# EAGLE design LBS-Simpleceiver Audio Pre-Amp and Amp Stage (EAGLE 9.2.2)
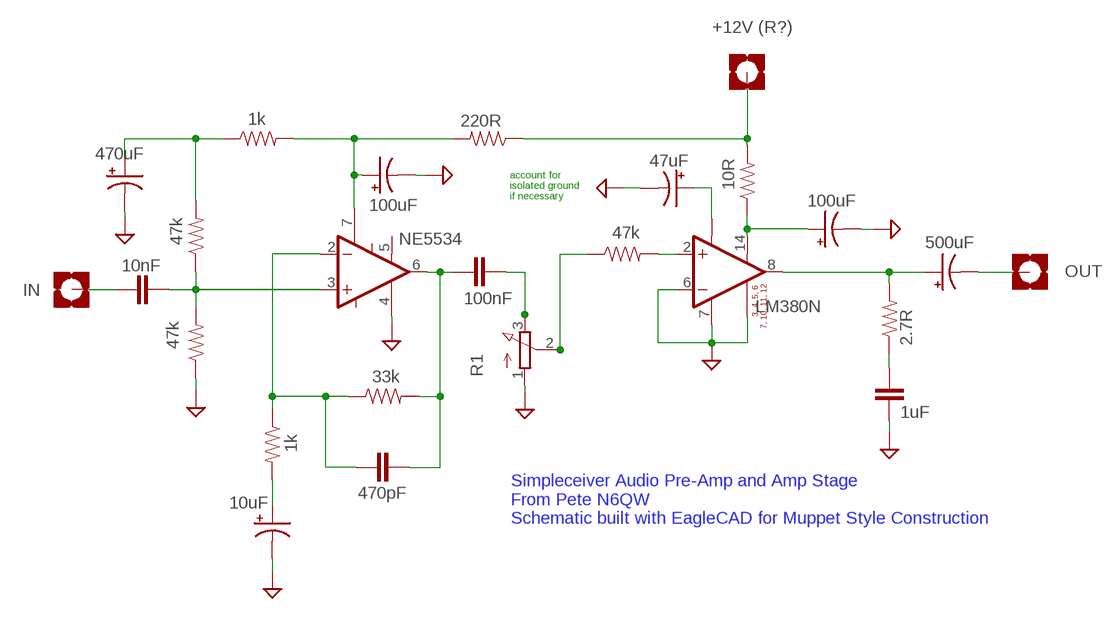
[diagram p0: schematic, sheet 1]

## Parts
C1  470uF  CAP-POLARIZED-RADIAL-2.5MM-25V-20%  [CAP-POLARIZED]
C2  100uF  CAP-POLARIZED-RADIAL-2.5MM-25V-20%  [CAP-POLARIZED]
C3  500uF  CAP-POLARIZED-RADIAL-2.5MM-25V-20%  [CAP-POLARIZED]
C4  47uF  CAP-POLARIZED-RADIAL-2.5MM-25V-20%  [CAP-POLARIZED]
C5  10uF  CAP-POLARIZED-RADIAL-2.5MM-25V-20%  [CAP-POLARIZED]
C6  100uF  CAP-POLARIZED-RADIAL-2.5MM-25V-20%  [CAP-POLARIZED]
C7  10nF  CAP-MEDIUM-MUPPET  [CAP-MEDIUM-MUPPET]
C8  100nF  CAP-MEDIUM-MUPPET  [CAP-MEDIUM-MUPPET]
C9  1uF  CAP-MEDIUM-MUPPET  [CAP-MEDIUM-MUPPET]
C10  470pF  CAP-MEDIUM-MUPPET  [CAP-MEDIUM-MUPPET]
H1  IN  MOUNT-PAD-SQUARE4.5  [PAD-SQUARE]
H2  OUT  MOUNT-PAD-SQUARE4.5  [PAD-SQUARE]
H3  +12V (R?)  MOUNT-PAD-SQUARE4.5  [PAD-SQUARE]
IC1  NE5534  NE5534-OP-AMPDIL8  [DIL08]
R1  POTENTIOMETER  [POTENTIOMETER]
R2  47k  RESISTOR-MUPPETMEDIUM-RESISTOR-PADS  [RESITOR-MUPPET]
R3  47k  RESISTOR-MUPPETMEDIUM-RESISTOR-PADS  [RESITOR-MUPPET]
R4  1k  RESISTOR-MUPPETMEDIUM-RESISTOR-PADS  [RESITOR-MUPPET]
R5  33k  RESISTOR-MUPPETMEDIUM-RESISTOR-PADS  [RESITOR-MUPPET]
R8  220R  RESISTOR-MUPPETMEDIUM-RESISTOR-PADS  [RESITOR-MUPPET]
R9  2.7R  RESISTOR-MUPPETMEDIUM-RESISTOR-PADS  [RESITOR-MUPPET]
U1  LM380N  LM380N-AUDIO-PWR-AMPDIL14  [DIL14]
U$4  1k  RESISTOR-MUPPETMEDIUM-RESISTOR-PADS  [RESITOR-MUPPET]
U$6  47k  RESISTOR-MUPPETMEDIUM-RESISTOR-PADS  [RESITOR-MUPPET]
U$7  10R  RESISTOR-MUPPETMEDIUM-RESISTOR-PADS  [RESITOR-MUPPET]

## Nets
GND: C1.2(-) C2.2(-) C4.2(-) C5.2(-) C6.2(-) C9.2 IC1.4(VCC-GND) R1.1(A) R3.P$1 U1.3(GND) U1.4(GND) U1.5(GND) U1.6(-IN) U1.7(GND1) U1.10(GND) U1.11(GND) U1.12(GND)
N$1: C7.1 H1.PAD(MOUNT)
N$2: C7.2 IC1.3(+IN) R2.P$1 R3.P$2
N$3: C1.1(+) R2.P$2 R4.P$1
N$4: C6.1(+) IC1.7(VCC+) R4.P$2 R8.P$2
N$5: C8.2 C10.1 IC1.6(OUT) R5.P$2
N$6: C10.2 IC1.2(-IN) R5.P$1 U$4.P$1
N$7: C5.1(+) U$4.P$2
N$8: C8.1 R1.3(E)
N$9: R1.2(S) U$6.P$1
N$10: U1.2(+IN) U$6.P$2
N$11: C2.1(+) U1.14(V-SIG) U$7.P$1
N$12: H3.PAD(MOUNT) R8.P$1 U$7.P$2
N$13: C3.1(+) R9.P$2 U1.8(GAIN)
N$14: C9.1 R9.P$1
N$15: C4.1(+) U1.1(BYPASS)
N$16: C3.2(-) H2.PAD(MOUNT)
Unconnected: IC1.1(BALANCE) IC1.5(COMP) IC1.8(COMP/BAL)

## Notes on the sheet
- account for 
  isolated ground
  if necessary
- Simpleceiver Audio Pre-Amp and Amp Stage
  From Pete N6QW 
  Schematic built with EagleCAD for Muppet Style Construction

## Library data of the parts
C1 C3-C5 = jim_muppet_parts:CAP-POLARIZED: 100µF polarized capacitors A capacitor is a passive two-terminal electrical component used to store electrical energy temporarily in an electric field.; PROD_ID: CAP-08439; VALUE: 100uF
C2 C6 = jim_muppet_parts:CAP-POLARIZED: 100µF polarized capacitors A capacitor is a passive two-terminal electrical component used to store electrical energy temporarily in an electric field.; PROD_ID: CAP-08439
C7-C10 = jim_muppet_parts:CAP-MEDIUM-MUPPET: Capacitor - Muppet style - Medium size SMT Pads 120 square SMT pads; PROD_ID: JIM-CAP Large SMT; VALUE: Set 0.0uF
H1-H3 = jim_muppet_parts:MOUNT-PAD-SQUARE: MOUNTING PAD, square
IC1 = jim_muppet_parts:NE5534-OP-AMP: NE5534x, SA5534x Low-Noise Operational Amplifiers
R1 = jim_muppet_parts:POTENTIOMETER: 16mm Potentiometer one level Source: http://www.alphapotentiometers.net/html/16mm_pot_2.html
R2-R5 R8 R9 U$4 U$6 U$7 = jim_muppet_parts:RESISTOR-MUPPET: Muppet stype resitor 120 square pad; PROD_ID: MUP-RES; VALUE: ohm
U1 = jim_muppet_parts:LM380N-AUDIO-PWR-AMP: 2.5W Audio Power Amplifier

## Net classes
0 default: width 0.813 mm, clearance 1.016 mm

## Board
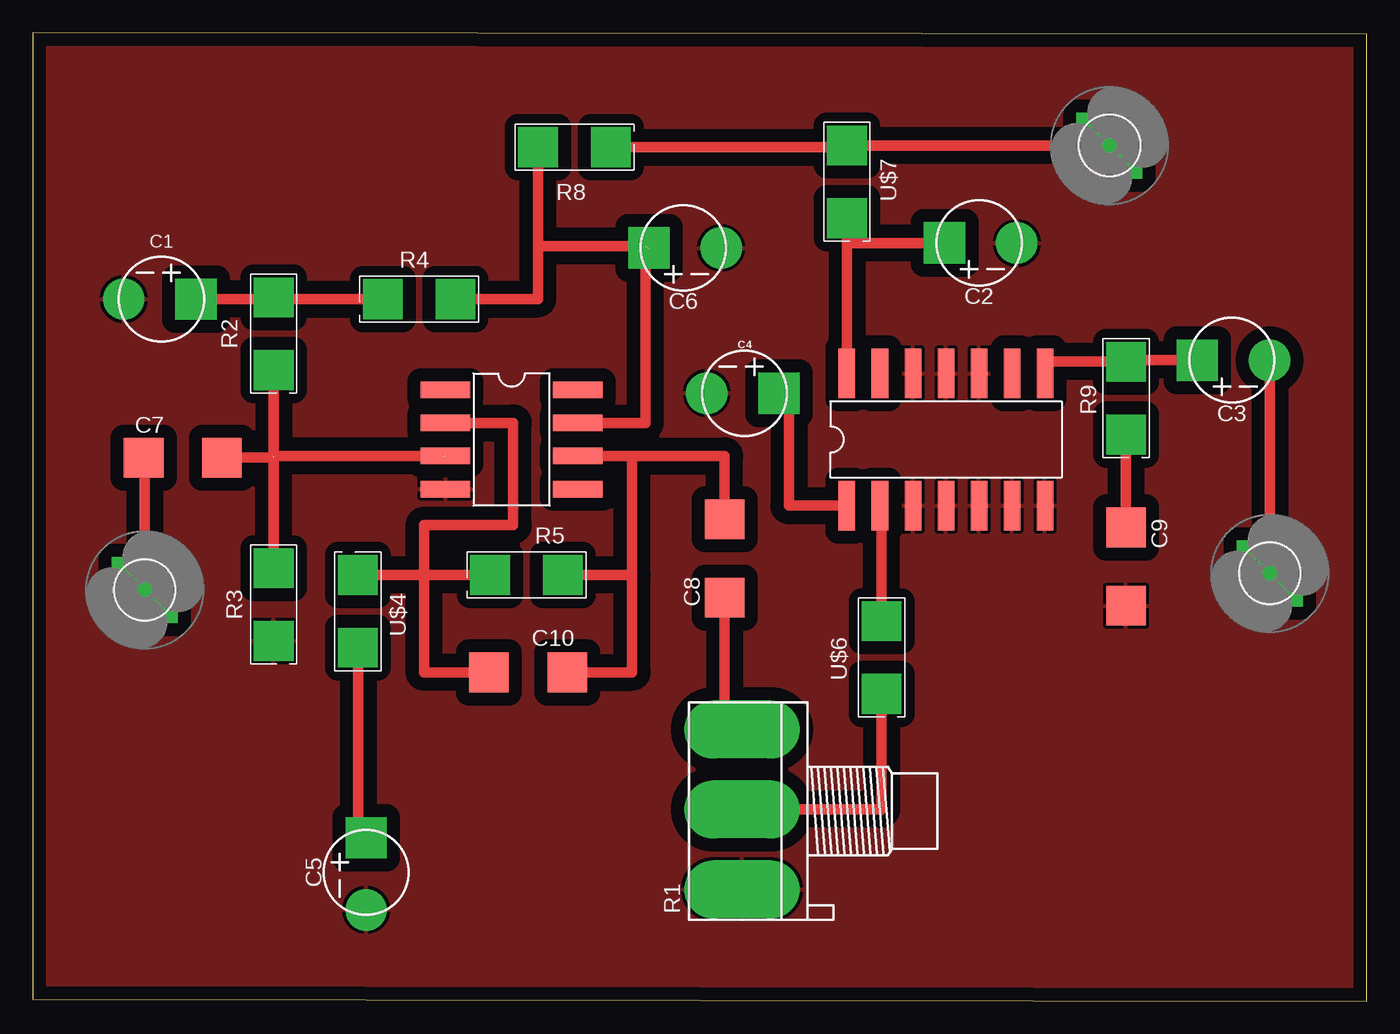
[diagram p1: board, top side]

Size 102.6 x 74.47 mm. Coordinates in mm from the lower left corner, seen from the top.
Outline: 0,0.13 102.6,0 102.6,74.35 0,74.47 0,0.13
Copper layers (1*16): Top 0.035mm / dielectric 1.5mm / Bottom 0.035mm
Design rules "default": minimum track width 6mil, minimum drill 0.35mm, track to track 6mil, track to pad 6mil, pad to pad 6mil, via to via 6mil, smd to smd 6mil, copper to edge 40mil, drill to drill 6mil, minimum pad ring 10mil, minimum via ring 8mil, stop-mask expansion 4mil, vias tented up to drill 0mil, thermal gap 10mil

### Footprints (pad centres in the part's own frame; a part is rotated, then mirrored left to right if it is on the bottom)
CAP-POLARIZED = drill 0 pad 3.175 square: 1 2.647,0 | drill 0 pad 3.175: 2 -2.901,0
CAP-MEDIUM-MUPPET = smd 3.048 x 3.048: 1 -3.009,0; 2 3.009,0
PAD-SQUARE = drill 0 pad 5.08 square: PAD 0,0
DIL08 = smd 1.27 x 3.81: 1 -3.81,-5.08; 2 -1.27,-5.08; 3 1.27,-5.08; 4 3.81,-5.08; 5 3.81,5.08; 6 1.27,5.08; 7 -1.27,5.08; 8 -3.81,5.08
POTENTIOMETER = drill 0 pad 4.445 offset: 1 -6.016,-0.889; 2 0.127,-0.889; 3 6.27,-0.889
RESITOR-MUPPET = drill 0 pad 3.048 square: P$1 -2.794,0; P$2 2.794,0
DIL14 = smd 1.27 x 3.81: 1 -3.81,-5.08; 2 -1.27,-5.08; 3 1.27,-5.08; 4 3.81,-5.08; 5 6.35,-5.08; 6 8.89,-5.08; 7 11.43,-5.08; 8 11.43,5.08; 9 8.89,5.08; 10 6.35,5.08; 11 3.81,5.08; 12 1.27,5.08; 13 -1.27,5.08; 14 -3.81,5.08

### Placement (x,y rotation side)
C1  9.91,53.98 0 top
C2  72.77,58.29 180 top
C3  92.2,49.28 180 top
C4  54.74,46.74 0 top
C5  25.65,9.91 90 top
C6  50.04,57.91 180 top
C7  11.56,41.78 0 top
C8  53.21,34.04 90 top
C9  84.07,33.4 270 top
C10  38.1,25.27 180 top
H1  8.64,31.62 0 top
H2  95.12,32.89 0 top
H3  82.8,65.79 0 top
IC1  36.83,43.18 270 top
R1  55.88,14.61 90 top
R2  18.54,51.31 90 top
R3  18.54,30.48 90 top
R4  29.72,53.98 0 top
R5  37.97,32.77 0 top
R8  41.66,65.66 180 top
R9  84.07,46.36 90 top
U1  66.42,43.18 0 top
U$4  25.02,29.97 270 top
U$6  65.28,26.42 90 top
U$7  62.61,62.99 90 top

### Tracks (layer width: path | path; a pad name or v marks a point on that pad's centre or on a via)
GND
  pour Top: 0,0.13 0,74.68 102.74,74.68 102.74,0.13
N$1
  Top 0.813: C7.1 8.64,41.7 H1.PAD
N$2  (2 unrouted)
  Top 0.813: 31.62,41.91 18.54,41.91 R2.P$1 | R3.P$2 18.54,41.78 C7.2
N$3
  Top 0.813: 18.54,53.98 R4.P$1 | R2.P$2 18.54,53.98 | 18.54,53.98 C1.1
N$4  (1 unrouted)
  Top 0.813: IC1.7 47.12,44.45 47.12,58.04 38.86,58.04 | 38.86,58.04 38.86,53.98 R4.P$2 | 38.86,58.04 R8.P$2
N$5
  Top 0.813: 46.1,41.91 53.21,41.91 C8.2 | C10.1 46.1,25.27 46.1,32.77 | 46.1,32.77 R5.P$2 | 46.1,32.77 46.1,41.91 | IC1.6 46.1,41.91
N$6
  Top 0.813: 30.1,32.77 30.1,36.6 36.96,36.6 36.96,44.45 IC1.2 | C10.2 30.1,25.27 30.1,32.77 | R5.P$1 30.1,32.77 | 30.1,32.77 U$4.P$1
N$7
  Top 0.813: U$4.P$2 25.02,13.19 C5.1
N$8
  Top 0.813: C8.1 53.21,20.99 56.65,20.99 R1.3
N$9
  Top 0.813: U$6.P$1 65.28,14.73 R1.2
N$10
  Top 0.813: U$6.P$2 65.28,38.1 U1.2
N$11
  Top 0.813: U1.14 U$7.P$1 62.61,58.42 62.74,58.29 C2.1
N$12
  Top 0.813: H3.PAD U$7.P$2 62.61,65.66 R8.P$1
N$13
  Top 0.813: C3.1 84.2,49.28 R9.P$2 84.05,49.17 77.85,49.17 U1.8
N$14
  Top 0.813: R9.P$1 C9.1
N$15
  Top 0.813: 57.51,46.61 C4.1 58.15,45.97 58.15,38.1 U1.1
N$16
  Top 0.813: C3.2 95.12,49.26 H2.PAD